# EAGLE schematic Chess_MOD (EAGLE 7.6.0)
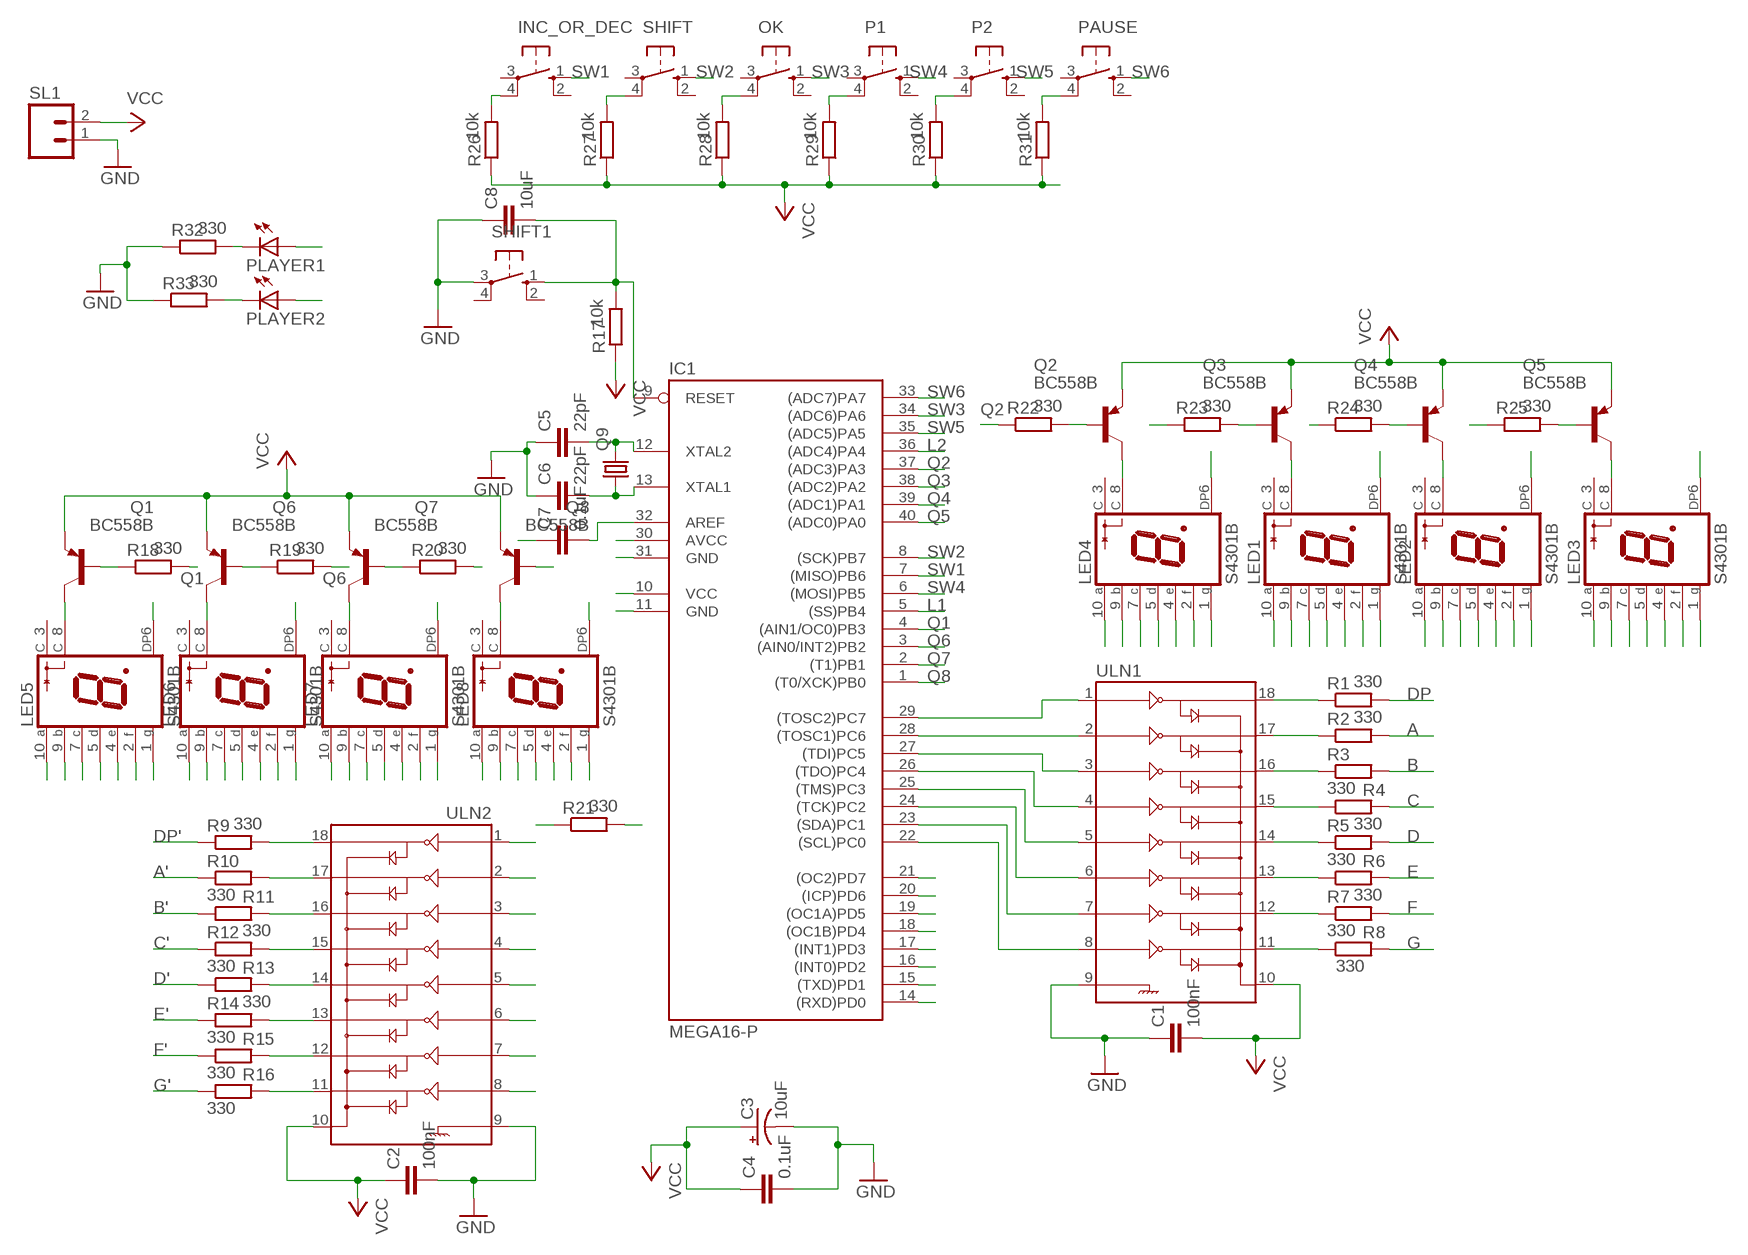
[diagram p0: schematic, sheet 1]

## Parts
C1  100nF  C-EU025-024X044  [C025-024X044]
C2  100nF  C-EU025-024X044  [C025-024X044]
C3  10uF  CPOL-USE2.5-7  [E2,5-7]
C4  0.1uF  C-EU025-024X044  [C025-024X044]
C5  22pF  C-EU025-024X044  [C025-024X044]
C6  22pF  C-EU025-024X044  [C025-024X044]
C7  0.1uF  C-EU025-024X044  [C025-024X044]
C8  10uF  C-EU025-024X044  [C025-024X044]
IC1  MEGA16-P  [DIL40]
INC_OR_DEC  10-XX  [B3F-10XX]
LED1  S4301B  [S4301B]
LED2  S4301B  [S4301B]
LED3  S4301B  [S4301B]
LED4  S4301B  [S4301B]
LED5  S4301B  [S4301B]
LED6  S4301B  [S4301B]
LED7  S4301B  [S4301B]
LED8  S4301B  [S4301B]
OK  10-XX  [B3F-10XX]
P1  10-XX  [B3F-10XX]
P2  10-XX  [B3F-10XX]
PAUSE  10-XX  [B3F-10XX]
PLAYER1  LED5MM  [LED5MM]
PLAYER2  LED5MM  [LED5MM]
Q1  BC558B  [TO92-EBC]
Q2  BC558B  [TO92-EBC]
Q3  BC558B  [TO92-EBC]
Q4  BC558B  [TO92-EBC]
Q5  BC558B  [TO92-EBC]
Q6  BC558B  [TO92-EBC]
Q7  BC558B  [TO92-EBC]
Q8  BC558B  [TO92-EBC]
Q9  CRYSTALHC49US  [HC49US]
R1  330  R-EU_0204/7  [0204/7]
R2  330  R-EU_0204/7  [0204/7]
R3  330  R-EU_0204/7  [0204/7]
R4  330  R-EU_0204/7  [0204/7]
R5  330  R-EU_0204/7  [0204/7]
R6  330  R-EU_0204/7  [0204/7]
R7  330  R-EU_0204/7  [0204/7]
R8  330  R-EU_0204/7  [0204/7]
R9  330  R-EU_0204/7  [0204/7]
R10  330  R-EU_0204/7  [0204/7]
R11  330  R-EU_0204/7  [0204/7]
R12  330  R-EU_0204/7  [0204/7]
R13  330  R-EU_0204/7  [0204/7]
R14  330  R-EU_0204/7  [0204/7]
R15  330  R-EU_0204/7  [0204/7]
R16  330  R-EU_0204/7  [0204/7]
R17  10k  R-EU_0204/7  [0204/7]
R18  330  R-EU_0204/7  [0204/7]
R19  330  R-EU_0204/7  [0204/7]
R20  330  R-EU_0204/7  [0204/7]
R21  330  R-EU_0204/7  [0204/7]
R22  330  R-EU_0204/7  [0204/7]
R23  330  R-EU_0204/7  [0204/7]
R24  330  R-EU_0204/7  [0204/7]
R25  330  R-EU_0204/7  [0204/7]
R26  10k  R-EU_0204/7  [0204/7]
R27  10k  R-EU_0204/7  [0204/7]
R28  10k  R-EU_0204/7  [0204/7]
R29  10k  R-EU_0204/7  [0204/7]
R30  10k  R-EU_0204/7  [0204/7]
R31  10k  R-EU_0204/7  [0204/7]
R32  330  R-EU_0204/7  [0204/7]
R33  330  R-EU_0204/7  [0204/7]
SHIFT  10-XX  [B3F-10XX]
SHIFT1  10-XX  [B3F-10XX]
SL1  M02  [02P]
ULN1  ULN2803DIP  [DIL18]
ULN2  ULN2803DIP  [DIL18]

## Nets
1: IC1.21((OC2)PD7) ULN2.1
2: IC1.20((ICP)PD6) ULN2.2
3: IC1.19((OC1A)PD5) ULN2.3
4: IC1.18((OC1B)PD4) ULN2.4
5: IC1.17((INT1)PD3) ULN2.5
6: IC1.16((INT0)PD2) ULN2.6
7: IC1.15((TXD)PD1) ULN2.7
8: IC1.14((RXD)PD0) ULN2.8
A: LED1.10(A) LED2.10(A) LED3.10(A) LED4.10(A) R2.2
A': LED5.10(A) LED6.10(A) LED7.10(A) LED8.10(A) R10.1
B: LED1.9(B) LED2.9(B) LED3.9(B) LED4.9(B) R3.2
B': LED5.9(B) LED6.9(B) LED7.9(B) LED8.9(B) R11.1
C: LED1.7(C) LED2.7(C) LED3.7(C) LED4.7(C) R4.2
C': LED5.7(C) LED6.7(C) LED7.7(C) LED8.7(C) R12.1
D: LED1.5(D) LED2.5(D) LED3.5(D) LED4.5(D) R5.2
D': LED5.5(D) LED6.5(D) LED7.5(D) LED8.5(D) R13.1
DP: LED1.6(DP) LED2.6(DP) LED3.6(DP) LED4.6(DP) R1.2
DP': LED5.6(DP) LED6.6(DP) LED7.6(DP) LED8.6(DP) R9.1
E: LED2.4(E) LED3.4(E) LED4.4(E) R6.2
E': LED5.4(E) LED6.4(E) LED7.4(E) LED8.4(E) R14.1
F: LED1.2(F) LED2.2(F) LED3.2(F) LED4.2(F) R7.2
F': LED5.2(F) LED6.2(F) LED7.2(F) LED8.2(F) R15.1
G: LED1.1(G) LED2.1(G) LED3.1(G) LED4.1(G) R8.2
G': LED5.1(G) LED6.1(G) LED7.1(G) LED8.1(G) R16.1
GND: C1.1 C2.2 C3.- C4.2 C5.1 C6.1 C8.1 IC1.11(GND) IC1.31(GND) R32.1 R33.1 SHIFT1.3(P) SL1.1 ULN1.9 ULN2.9
L1: IC1.5((SS)PB4) PLAYER1.A
L2: IC1.36((ADC4)PA4) PLAYER2.A
N$1: R1.1 ULN1.18
N$2: R2.1 ULN1.17
N$3: R3.1 ULN1.16
N$4: R4.1 ULN1.15
N$5: R5.1 ULN1.14
N$6: R6.1 ULN1.13
N$7: R7.1 ULN1.12
N$8: R8.1 ULN1.11
N$9: LED4.8(C) Q2.C
N$10: LED1.8(C) Q3.C
N$11: LED2.8(C) Q4.C
N$12: LED3.8(C) Q5.C
N$13: IC1.29((TOSC2)PC7) ULN1.1
N$14: IC1.28((TOSC1)PC6) ULN1.2
N$15: IC1.27((TDI)PC5) ULN1.3
N$16: IC1.26((TDO)PC4) ULN1.4
N$17: IC1.25((TMS)PC3) ULN1.5
N$18: IC1.24((TCK)PC2) ULN1.6
N$19: IC1.23((SDA)PC1) ULN1.7
N$20: LED1.4(E)
N$21: IC1.22((SCL)PC0) ULN1.8
N$22: LED5.8(C) Q1.C
N$23: LED6.8(C) Q6.C
N$24: LED7.8(C) Q7.C
N$25: LED8.8(C) Q8.C
N$26: C8.2 IC1.9(RESET) R17.2 SHIFT1.1(S)
N$27: C5.2 IC1.12(XTAL2) Q9.2
N$28: C6.2 IC1.13(XTAL1) Q9.1
N$29: C7.2 IC1.32(AREF)
N$30: Q1.B R18.1
N$31: Q6.B R19.1
N$32: Q7.B R20.1
N$33: Q2.B R22.2
N$34: Q3.B R23.2
N$35: Q4.B R24.2
N$36: R9.2 ULN2.18
N$37: R10.2 ULN2.17
N$38: R11.2 ULN2.16
N$39: R12.2 ULN2.15
N$40: R13.2 ULN2.14
N$41: R14.2 ULN2.13
N$42: R15.2 ULN2.12
N$43: R16.2 ULN2.11
N$44: Q5.B R25.2
N$45: INC_OR_DEC.4(P1) R26.2
N$46: R27.2 SHIFT.4(P1)
N$47: OK.4(P1) R28.2
N$48: P1.4(P1) R29.2
N$49: P2.4(P1) R30.2
N$50: PAUSE.4(P1) R31.2
N$51: PLAYER1.K(C) R32.2
N$52: PLAYER2.K(C) R33.2
Q1: IC1.4((AIN1/OC0)PB3) R18.2
Q2: IC1.37((ADC3)PA3) R22.1
Q3: IC1.38((ADC2)PA2) R23.1
Q4: IC1.39((ADC1)PA1) R24.1
Q5: IC1.40((ADC0)PA0) R25.1
Q6: IC1.3((AIN0/INT2)PB2) R19.2
Q7: IC1.2((T1)PB1) R20.2
Q8: IC1.1((T0/XCK)PB0) R21.2
SW1: IC1.7((MISO)PB6) INC_OR_DEC.1(S)
SW2: IC1.8((SCK)PB7) SHIFT.1(S)
SW3: IC1.34((ADC6)PA6) OK.1(S)
SW4: IC1.6((MOSI)PB5) P1.1(S)
SW5: IC1.35((ADC5)PA5) P2.1(S)
SW6: IC1.33((ADC7)PA7) PAUSE.1(S)
T1: Q8.B R21.1
VCC: C1.2 C2.1 C3.+ C4.1 C7.1 IC1.10(VCC) IC1.30(AVCC) Q1.E Q2.E Q3.E Q4.E Q5.E Q6.E Q7.E Q8.E R17.1 R26.1 R27.1 R28.1 R29.1 R30.1 R31.1 SL1.2 ULN1.10 ULN2.10
Unconnected: INC_OR_DEC.2(S1) INC_OR_DEC.3(P) LED1.3(C) LED2.3(C) LED3.3(C) LED4.3(C) LED5.3(C) LED6.3(C) LED7.3(C) LED8.3(C) OK.2(S1) OK.3(P) P1.2(S1) P1.3(P) P2.2(S1) P2.3(P) PAUSE.2(S1) PAUSE.3(P) SHIFT1.2(S1) SHIFT1.4(P1) SHIFT.2(S1) SHIFT.3(P)

## Library data of the parts
C1 C2 C4-C8 = rcl:C-EU: CAPACITOR, European symbol
C3 = rcl:CPOL-US: POLARIZED CAPACITOR, American symbol
IC1 = atmel:MEGA16-P: MICROCONTROLLER 16 Kbytes FLASH 1 kbytes SRAM 512 bytes EEPROM USART 8-channel 10 bit ADC Source: avr.lbr; MPN: ATMEGA16-16PU; OC_FARNELL: 9171142; OC_NEWARK: 01M6885
INC_OR_DEC OK P1 P2 PAUSE SHIFT SHIFT1 = switch-omron:10-XX: OMRON SWITCH; MPN: B3F-1000; OC_FARNELL: 176432; OC_NEWARK: 36M3542
LED1-LED8 = led-7-segment:S4301B: Single Digit Seven-Segment Display (cathode common) Source: LITEON .. S4301B.pdf; OC_FARNELL: unknown; OC_NEWARK: unknown
PLAYER1 PLAYER2 = led:LED: LED OSRAM: - CHIPLED LG R971, LG N971, LY N971, LG Q971, LY Q971, LO R971, LY R971 LH N974, LH R974 LS Q976, LO Q976, LY Q976 LO Q996 - Hyper CHIPLED LW Q18S LB Q993, LB Q99A, LB R99A - SideLED LS A670, LO A670, LY A670, LG A670, LP A670 LB A673, LV A673, LT A673, LW A673 LH A674 LY A675 LS A676, LA A676, LO A676, LY A676, LW A676 LS A679, LY A679, LG A679 - Hyper Micro SIDELED® LS Y876, LA Y876, LO Y876, LY Y876 LT Y87S - SmartLED LW L88C, LW L88S LB L89C, LB L89S, LG L890 LS L89K, LO L89K, LY L89K LS L896, LA L896, LO L896, LY L896 - TOPLED LS T670, LO T670, LY T670, LG T670, LP T670 LSG T670, LSP T670, LSY T670, LOP T670, LYG T670 LG T671, LOG T671, LSG T671 LB T673, LV T673, LT T673, LW T673 LH T674 LS T676, LA T676, LO T676, LY T676, LB T676, LH T676, LSB T676, LW T676 LB T67C, LV T67C, LT T67C, LS T67K, LO T67K, LY T67K, LW E67C LS E67B, LA E67B, LO E67B, LY E67B, LB E67C, LV E67C, LT E67C LW T67C LS T679, LY T679, LG T679 LS T770, LO T770, LY T770, LG T770, LP T770 LB T773, LV T773, LT T773, LW T773 LH T774 LS E675, LA E675, LY E675, LS T675 LS T776, LA T776, LO T776, LY T776, LB T776 LHGB T686 LT T68C, LB T68C - Hyper Mini TOPLED® LB M676 - Mini TOPLED Santana® LG M470 LS M47K, LO M47K, LY M47K Source: http://www.osram.convergy.de LUXEON: - LUMILED® LXK2-PW12-R00, LXK2-PW12-S00, LXK2-PW14-U00, LXK2-PW14-V00 LXK2-PM12-R00, LXK2-PM12-S00, LXK2-PM14-U00 LXK2-PE12-Q00, LXK2-PE12-R00, LXK2-PE12-S00, LXK2-PE14-T00, LXK2-PE14-U00 LXK2-PB12-K00, LXK2-PB12-L00, LXK2-PB12-M00, LXK2-PB14-N00, LXK2-PB14-P00, LXK2-PB14-Q00 LXK2-PR12-L00, LXK2-PR12-M00, LXK2-PR14-Q00, LXK2-PR14-R00 LXK2-PD12-Q00, LXK2-PD12-R00, LXK2-PD12-S00 LXK2-PH12-R00, LXK2-PH12-S00 LXK2-PL12-P00, LXK2-PL12-Q00, LXK2-PL12-R00 Source: www.luxeon.com KINGBRIGHT: KA-3528ASYC Source: www.kingbright.com
Q1-Q8 = transistor-pnp:BC558*: PNP Transistror
Q9 = CEDT_JANUARY_2015_v5:CRYSTAL: Crystals Various standard crystals. Proven footprints. Spark Fun Electronics SKU : COM-00534
R1-R33 = rcl:R-EU_: RESISTOR, European symbol
SL1 = CEDT_JANUARY_2015_v5:M02: AMP QUICK CONNECTOR
ULN1 ULN2 = SparkFun-PowerIC:ULN2803: Darlington Driver ULN2803 Darlington array. 500mA max per channel, 8-channel package. Spark Fun Electronics SKU : COM-00312